# EasyEDA Pro project ProPrj_IoT House_2026-04-28.epro, schematic Schematic3
Board Name: 10_Button_PCB; Create Date: 2026-01-28; Page Name: P1; Project Name: IoT House; Schematic Name: Schematic3; Update Date: 2026-01-28; Company: EasyEDA.com; Page Size: A4; Version: V1.0
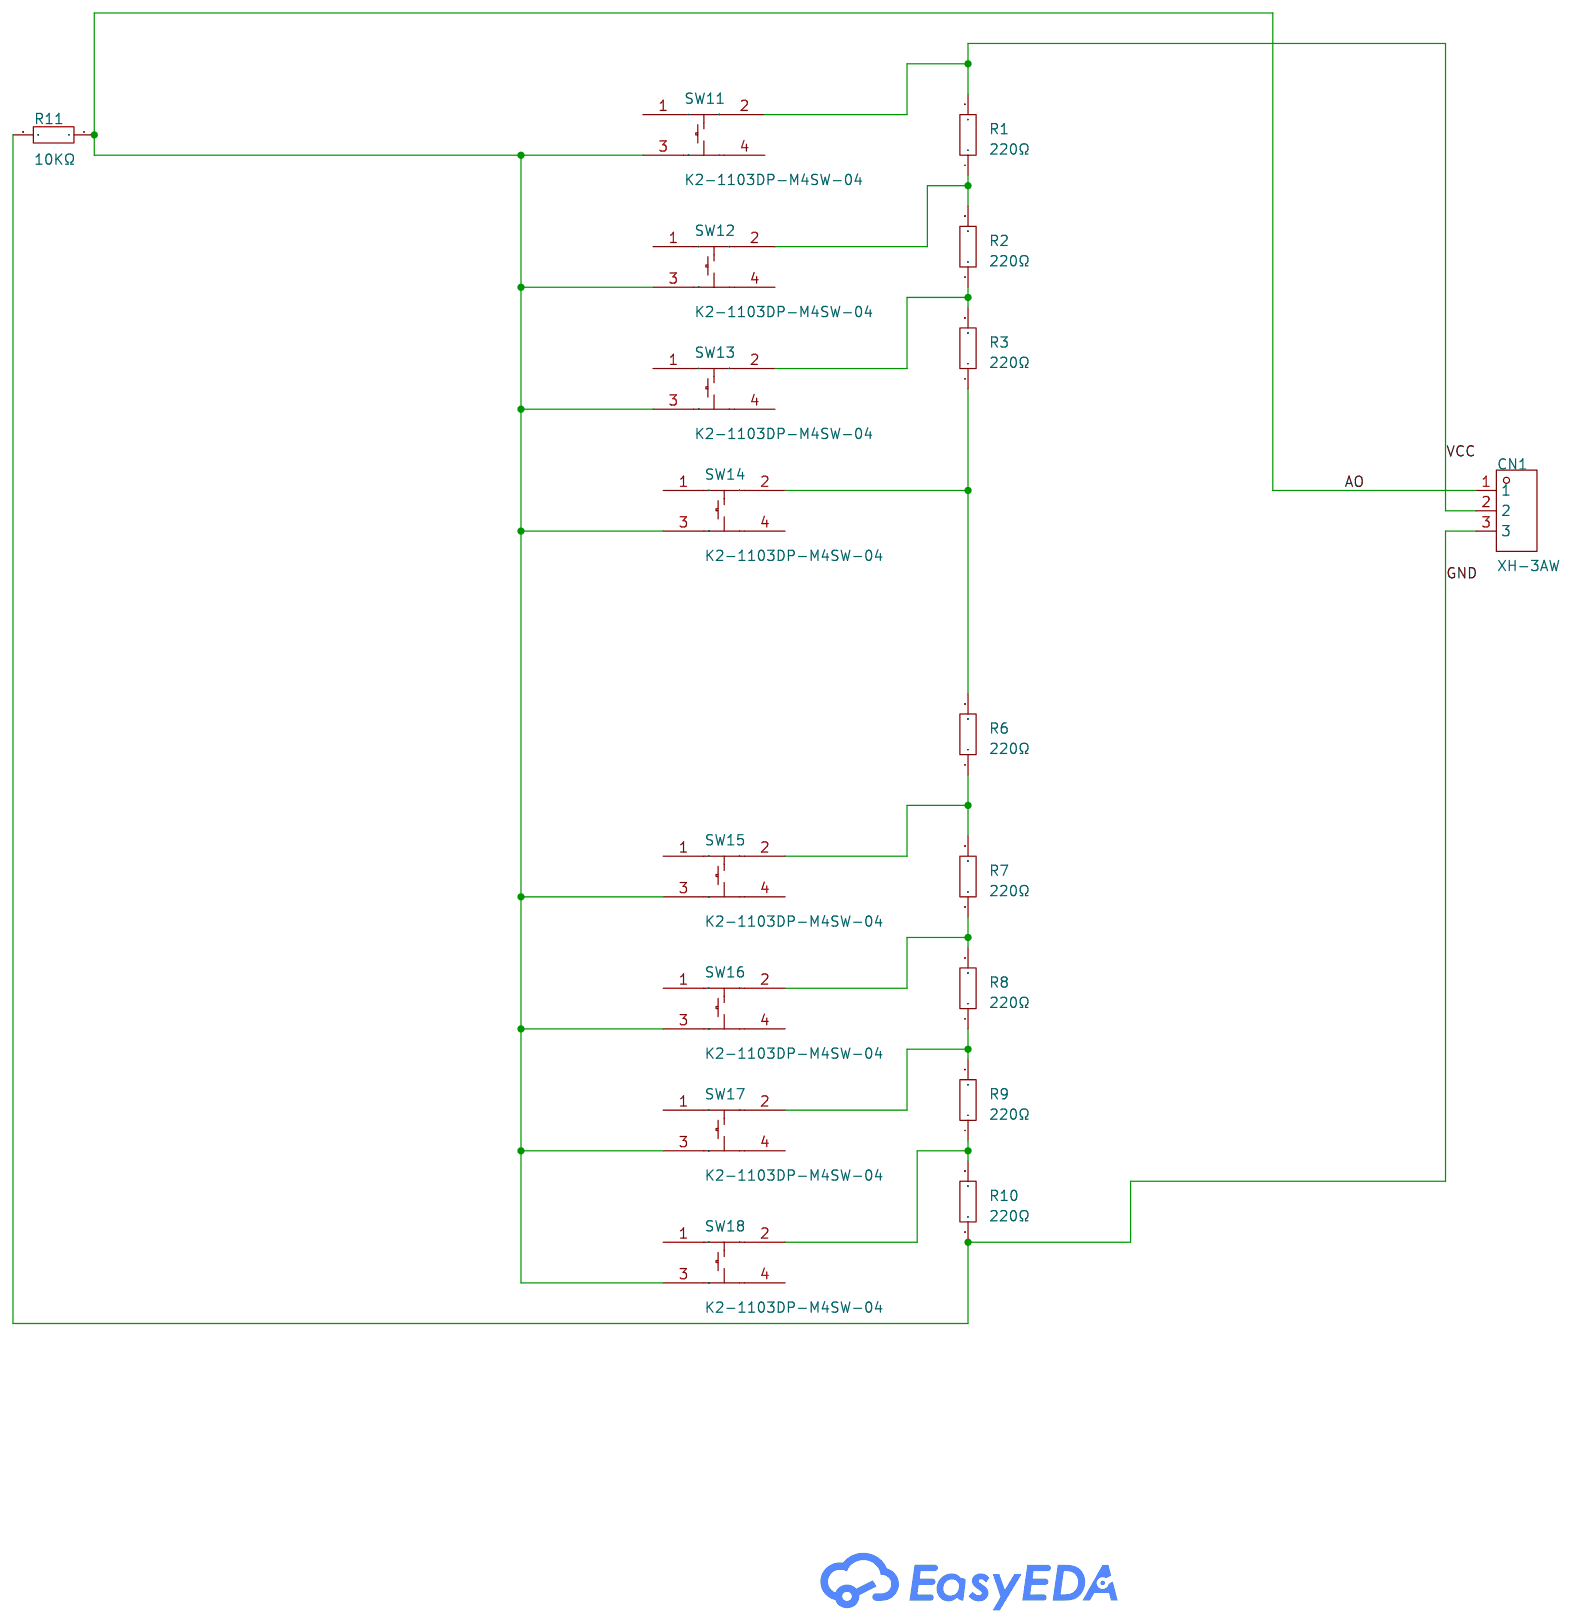
[diagram p3: schematic sheet]

## Parts
CN1  XH-3AW  [CONN-TH_XH-3AW-C722865]
R1  220Ω  [R_AXIAL-0.4]
R2  220Ω  [R_AXIAL-0.4]
R3  220Ω  [R_AXIAL-0.4]
R6  220Ω  [R_AXIAL-0.4]
R7  220Ω  [R_AXIAL-0.4]
R8  220Ω  [R_AXIAL-0.4]
R9  220Ω  [R_AXIAL-0.4]
R10  220Ω  [R_AXIAL-0.4]
R11  10KΩ  [R_AXIAL-0.4]
SW11  K2-1103DP-M4SW-04  [SW-TH_4P-L12.0-W12.0-P5.00-LS12.5_TC-1103XX]
SW12  K2-1103DP-M4SW-04  [SW-TH_4P-L12.0-W12.0-P5.00-LS12.5_TC-1103XX]
SW13  K2-1103DP-M4SW-04  [SW-TH_4P-L12.0-W12.0-P5.00-LS12.5_TC-1103XX]
SW14  K2-1103DP-M4SW-04  [SW-TH_4P-L12.0-W12.0-P5.00-LS12.5_TC-1103XX]
SW15  K2-1103DP-M4SW-04  [SW-TH_4P-L12.0-W12.0-P5.00-LS12.5_TC-1103XX]
SW16  K2-1103DP-M4SW-04  [SW-TH_4P-L12.0-W12.0-P5.00-LS12.5_TC-1103XX]
SW17  K2-1103DP-M4SW-04  [SW-TH_4P-L12.0-W12.0-P5.00-LS12.5_TC-1103XX]
SW18  K2-1103DP-M4SW-04  [SW-TH_4P-L12.0-W12.0-P5.00-LS12.5_TC-1103XX]

## Library data of the parts
CN1 = XH-3AW: Pins Structure:1x3P Pitch:2.5mm Mounting Type:Right Angle Reference Series:- Number of Pins:3P Number of Rows:1 Number of PINs Per Row:3 Row Spacing:- Current Rating:2A Contact Material:Brass Operating Temperature:-25℃~+85℃ Operating Temperature:-25℃~+85℃; LCSC Part Name: 1x3P 间距:2.5mm 弯插; Supplier Part: C722865; Manufacturer: CAX(创都); Supplier Footprint: 弯插,P=2.5mm; JLCPCB Part Class: Extended Part; Datasheet: https://item.szlcsc.com/datasheet/XH-3AW/767072.html; Supplier: LCSC; Pins Structure: 1x3P; Pitch: 2.5mm; Mounting Type: Right Angle; Number of Pins: 3P; Number of Rows: 1; Number of PINs Per Row: 3; Current Rating: 2A; Contact Material: Brass; Operating Temperature: -25℃~+85℃; Voltage Rating: 250V; Plastic Material: PA66; Z-Height of the Board: 5.8mm; X-Length of Bottom Edge on Board (Spacing Line): 10mm; Y-Width of Bottom Edge on Board: 7mm
R1-R3 R6-R11 = Res_AXIAL-1/4W: Supplier Footprint: Through
SW11-SW18 = K2-1103DP-M4SW-04: Supplier Part: C136702; Supplier Footprint: 12x12mm; JLCPCB Part Class: Extended Part; Supplier: LCSC

## Nets
GND: CN1.3 R10.1 R11.2
VCC: CN1.2 R1.2 SW11.2
AO: CN1.1 R11.1 SW11.3 SW12.3 SW13.3 SW14.3 SW15.3 SW16.3 SW17.3 SW18.3
Net-(R1-1): R1.1 R2.2 SW12.2
Net-(R2-1): R2.1 R3.2 SW13.2
Net-(R3-1): R3.1 R6.2 SW14.2
Net-(R6-1): R6.1 R7.2 SW15.2
Net-(R7-1): R7.1 R8.2 SW16.2
Net-(R8-1): R8.1 R9.2 SW17.2
Net-(R9-1): R9.1 R10.2 SW18.2

Not connected (* = marked no-connect by the designer): SW11 1 4; SW12 1 4; SW13 1 4; SW14 1 4; SW15 1 4; SW16 1 4; SW17 1 4; SW18 1 4
